# Altium schematic sheet Connectors.SchDoc
size A3; SheetNumber: 7; SheetTotal: 7
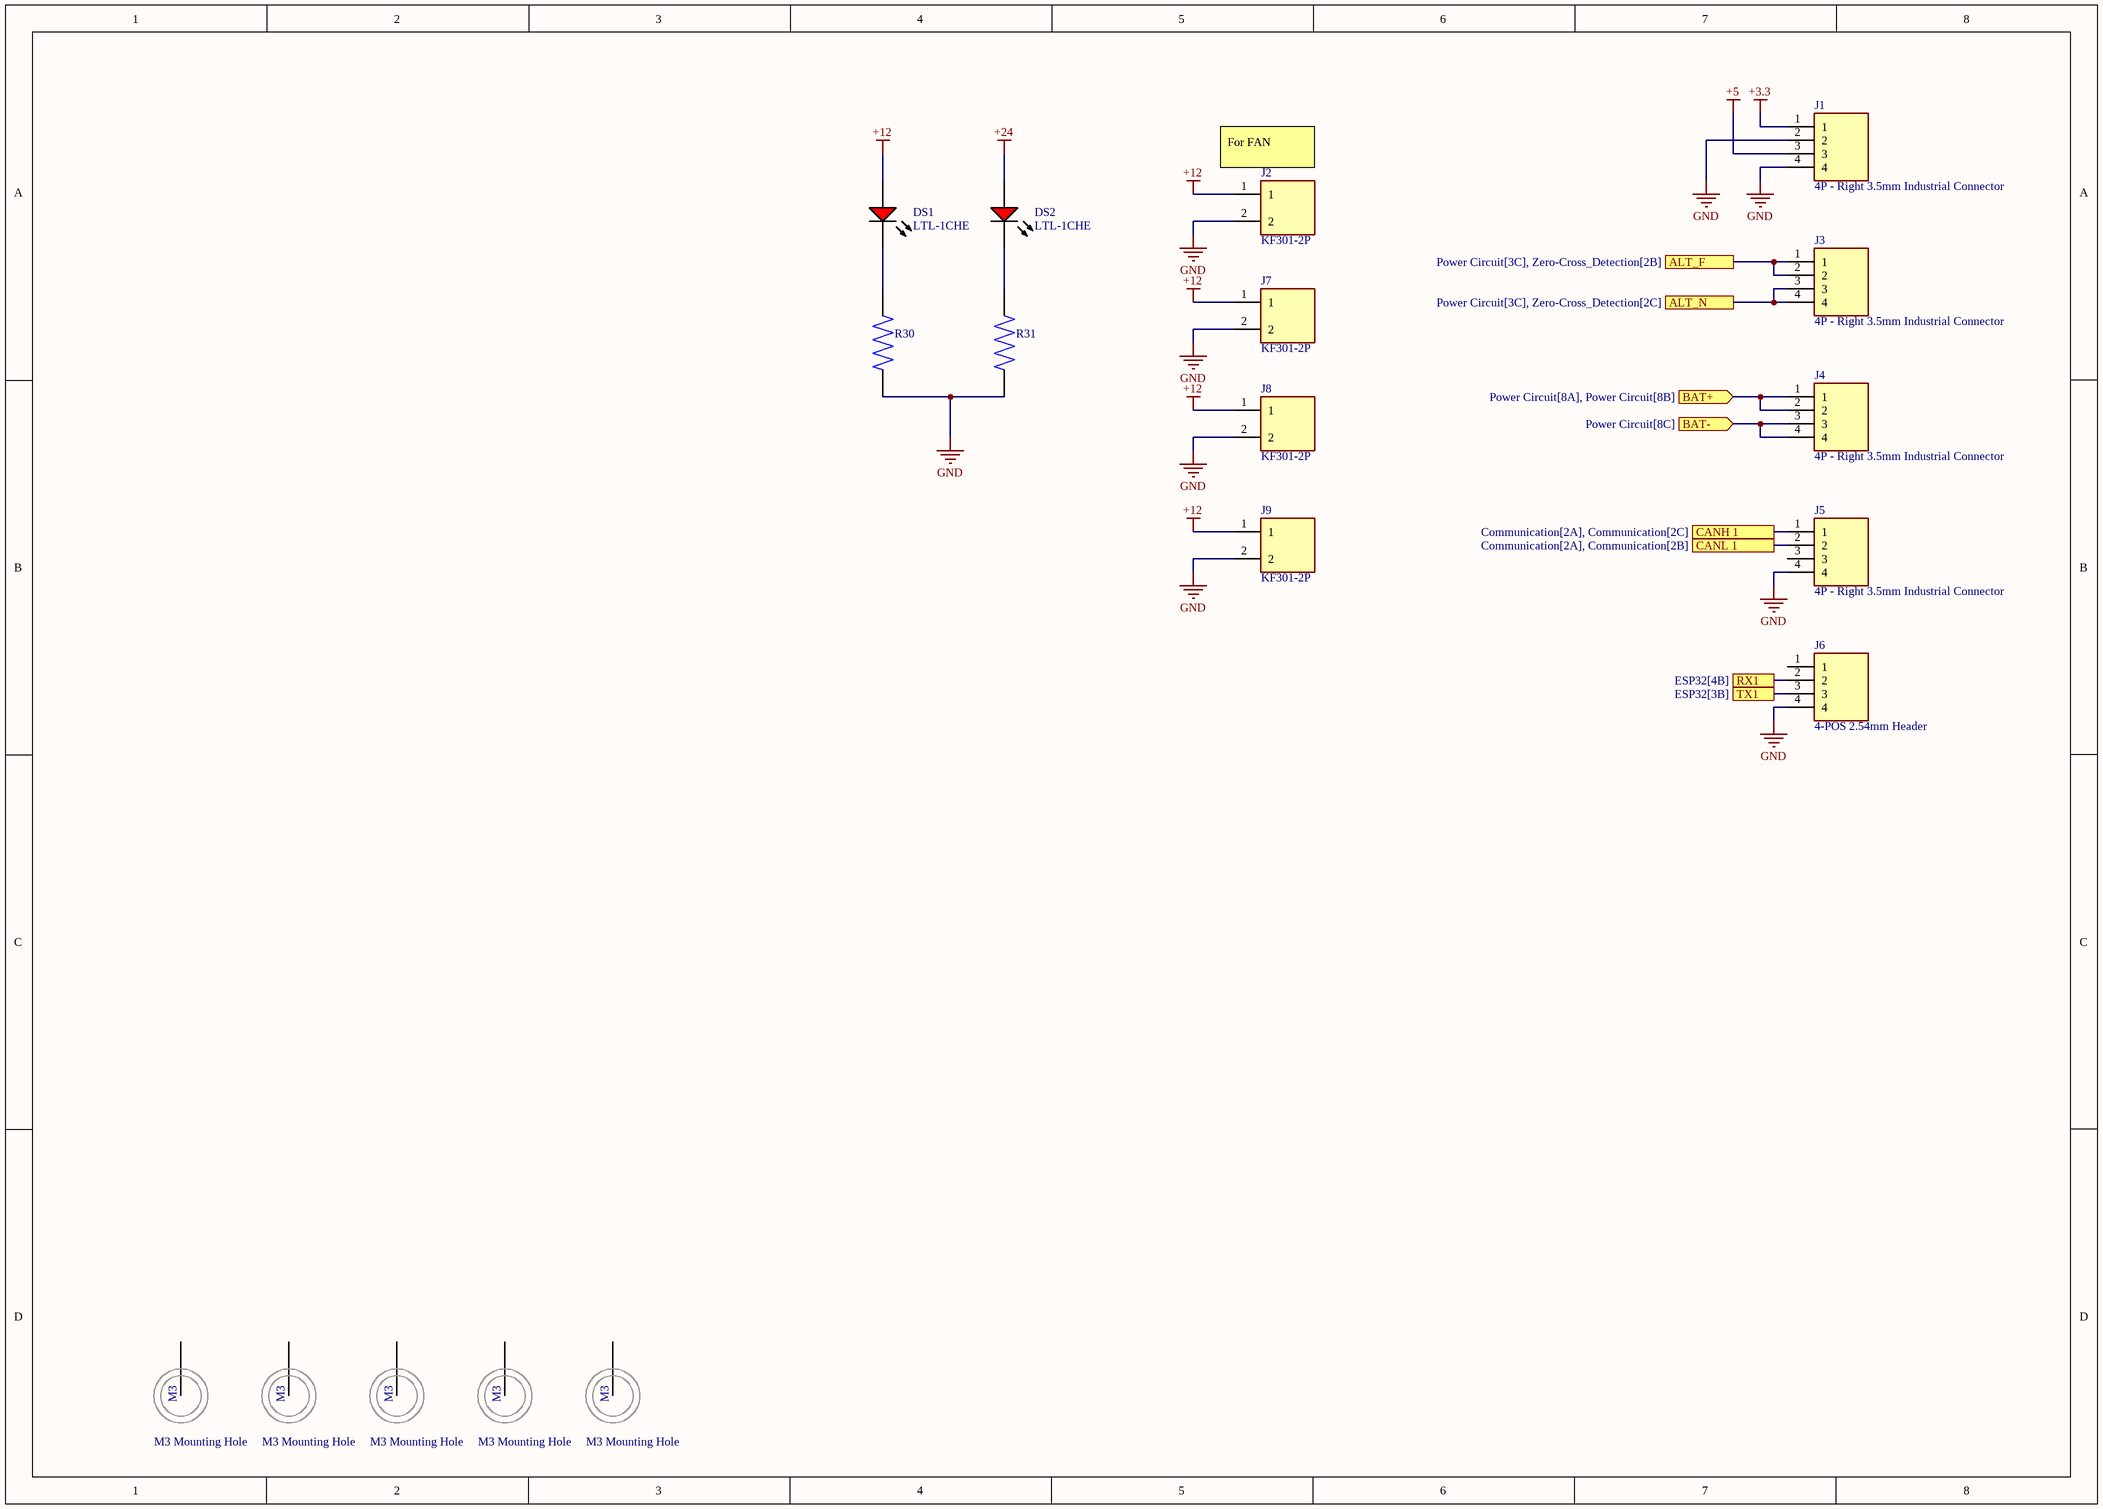
[diagram p0: Connectors.SchDoc]

## Parts
(Parts that share a designator on the sheet are numbered #1, #2 ... from top to bottom, then left to right.)
?#1  M3 Mounting Hole  [M3 - Mounting Hole]
?#2  M3 Mounting Hole  [M3 - Mounting Hole]
?#3  M3 Mounting Hole  [M3 - Mounting Hole]
?#4  M3 Mounting Hole  [M3 - Mounting Hole]
?#5  M3 Mounting Hole  [M3 - Mounting Hole]
DS1  LTL-1CHE  [LED3mm]
DS2  LTL-1CHE  [LED3mm]
J1  4P - Right 3.5mm Industrial Connector  [4P - Right 3.5mm Industrial Connector]
J2  KF301-2P  [KF301-2P]
J3  4P - Right 3.5mm Industrial Connector  [4P - Right 3.5mm Industrial Connector]
J4  4P - Right 3.5mm Industrial Connector  [4P - Right 3.5mm Industrial Connector]
J5  4P - Right 3.5mm Industrial Connector  [4P - Right 3.5mm Industrial Connector]
J6  4-POS 2.54mm Header  [4-POS 2.54mm Header]
J7  KF301-2P  [KF301-2P]
J8  KF301-2P  [KF301-2P]
J9  KF301-2P  [KF301-2P]
R30  Resistor_Through Hole  [Resistor_Through Hole]  (value not drawn)
R31  Resistor_Through Hole  [Resistor_Through Hole]  (value not drawn)

## Ports
ALT_F (see Power Circuit[3C], Zero-Cross_Detection[2B]), ALT_N (see Power Circuit[3C], Zero-Cross_Detection[2C]), BAT+ (in, see Power Circuit[8A], Power Circuit[8B]), BAT- (in, see Power Circuit[8C]), CANH 1 (see Communication[2A], Communication[2C]), CANL 1 (see Communication[2A], Communication[2B]), RX1 (see ESP32[4B]), TX1 (see ESP32[3B])

## Nets
+3.3: J1.1
+5: J1.3
+12: DS1.1(A) J2.1 J7.1 J8.1 J9.1
+24: DS2.1(A)
GND: J1.2 J1.4 J2.2 J5.4 J6.4 J7.2 J8.2 J9.2 R30.2 R31.2
ALT_F: J3.1 J3.2 ; port ALT_F
ALT_N: J3.3 J3.4 ; port ALT_N
BAT+: J4.1 J4.2 ; port BAT+
BAT-: J4.3 J4.4 ; port BAT-
CANH 1: J5.1 ; port CANH 1
CANL 1: J5.2 ; port CANL 1
RX1: J6.2 ; port RX1
TX1: J6.3 ; port TX1
NetDS1_2: DS1.2(K) R30.1
NetDS2_2: DS2.2(K) R31.1

Not connected (* = marked no-connect by the designer): ?#1 1(M3); ?#2 1(M3); ?#3 1(M3); ?#4 1(M3); ?#5 1(M3); J5 3; J6 1

## Notes on the sheet
- (near J2) For FAN

## Library data of the parts
DS1 DS2 = RED_LED 3mm: Radial LED, 12.6 mcd, 20 mA, 2 V, -55 to 100 degC, 2-Pin THD, RoHS, Bulk; Shielding: Unshielded; Resistance: 0.045 Ohm; Current Rating: 3.6 A; Tolerance: 20%; PackageReference: LTL-1CHE; PackageDescription: 2-Pin Through Hole Device, Dia 3.8 mm, Pitch 2.54 mm; Case\Package: Radial; Length: 0.97 inch; Width: 0.62 inch; Height: 1.1 inch; Radiation Hardening: No; Lead Pitch: 11.44 mm; ComponentLink1URL: http://www.us.liteon.com/; ComponentLink1Description: Manufacturer URL; RoHSCompliant: true; Packaging: Tray; Mount: Through Hole; Min Operating Temperature: -40 degC; Max Operating Temperature: 130 degC; ComponentLink2URL: https://datasheet.ciiva.com/15117/getdatasheetpartid-187746-15117985.pdf; Package Quantity: 55; ComponentLink2Description: Datasheet; DatasheetVersion: Dec-03
J1 J3-J5 = 4P - Right 3.5mm Industrial Connector: MP: 5-146290-4; Package: None; Price: None; Value: *; Availability: Unavailable
J2 J7-J9 = KF301-2P: 2 Pin Terminal Block 5mm Pitch; Price: None; Value: *; MP: KF301-2P; Package: None; Availability: Unavailable
J6 = 4-POS 2.54mm Header: MP: 5-146290-4; Package: None; Price: None; Value: *; Availability: Unavailable
R30 R31 = Resistor_Through Hole: 1.02 Ohms Â±1% 0.25W, 1/4W Through Hole Resistor Axial Metal Film; MP: MFR-25FTE52-1R; MF: Yageo; Availability: Warning; Value: *; Check_prices: https://www.snapeda.com/parts/MFR-25FTE52-1R/Yageo/view-part/4629919/?ref=eda; Package: Axial Yageo; Price: None; SnapEDA_Link: https://www.snapeda.com/parts/MFR-25FTE52-1R/Yageo/view-part/4629919/?ref=snap; Purchase-URL: https://pricing.snapeda.com/search/part/MFR-25FTE52-1R/?ref=eda